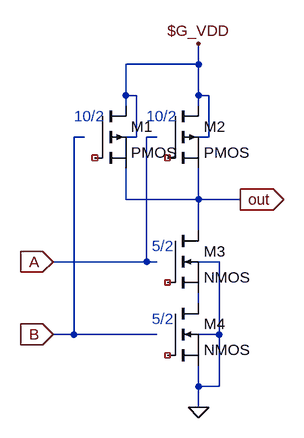
[diagram p0: schematic nand2a.asc]
nand2a.asc, the LTspice schematic file:
Version 4
SHEET 1 1292 680
WIRE -1184 -416 -1184 -448
WIRE -1184 -416 -1296 -416
WIRE -1296 -368 -1296 -416
WIRE -1280 -368 -1296 -368
WIRE -1184 -368 -1184 -416
WIRE -1168 -368 -1184 -368
WIRE -1296 -352 -1296 -368
WIRE -1184 -352 -1184 -368
WIRE -1360 -304 -1376 -304
WIRE -1280 -304 -1280 -368
WIRE -1280 -304 -1296 -304
WIRE -1248 -304 -1264 -304
WIRE -1168 -304 -1168 -368
WIRE -1168 -304 -1184 -304
WIRE -1296 -208 -1296 -256
WIRE -1184 -208 -1184 -256
WIRE -1184 -208 -1296 -208
WIRE -1120 -208 -1184 -208
WIRE -1184 -160 -1184 -208
WIRE -1264 -112 -1264 -304
WIRE -1264 -112 -1408 -112
WIRE -1248 -112 -1264 -112
WIRE -1152 -112 -1184 -112
WIRE -1184 -48 -1184 -64
WIRE -1376 0 -1376 -304
WIRE -1376 0 -1408 0
WIRE -1248 0 -1376 0
WIRE -1152 0 -1152 -112
WIRE -1152 0 -1184 0
WIRE -1184 80 -1184 48
WIRE -1152 80 -1152 0
WIRE -1152 80 -1184 80
WIRE -1184 112 -1184 80
FLAG -1184 112 0
FLAG -1120 -208 out
IOPIN -1120 -208 Out
FLAG -1184 -448 $G_VDD
FLAG -1408 -112 A
IOPIN -1408 -112 In
FLAG -1408 0 B
IOPIN -1408 0 In
SYMBOL pmos -1232 -352 R0
SYMATTR InstName M2
SYMATTR Value2 l=0.6u w=3u
SYMBOL nmos -1232 -48 R0
SYMATTR InstName M4
SYMATTR Value2 l=0.6u w=1.5u
SYMATTR SpiceModel ""
SYMATTR Value NMOS
SYMBOL pmos -1344 -352 R0
SYMATTR InstName M1
SYMATTR Value2 l=0.6u w=3u
SYMATTR SpiceModel ""
SYMATTR Value PMOS
SYMBOL nmos -1232 -160 R0
SYMATTR InstName M3
SYMATTR Value2 l=0.6u w=1.5u
SYMATTR SpiceModel ""
SYMATTR Value NMOS
TEXT -1264 -336 Left 2 ;10/2
TEXT -1376 -336 Left 2 ;10/2
TEXT -1256 -136 Left 2 ;5/2
TEXT -1256 -24 Left 2 ;5/2

The netlist it stands for:
* nand2a.asc
* M2: PMOS l=0.6u w=3u (symbol pmos not certain, pin order unknown); nets seen at it: $G_VDD, out
* M4: NMOS l=0.6u w=1.5u (symbol nmos not certain, pin order unknown); nets seen at it: 0, N001
* M1: PMOS l=0.6u w=3u (symbol pmos not certain, pin order unknown); nets seen at it: $G_VDD, out
* M3: NMOS l=0.6u w=1.5u (symbol nmos not certain, pin order unknown); nets seen at it: N001, out
* 10/2
* 10/2
* 5/2
* 5/2
.backanno
.end